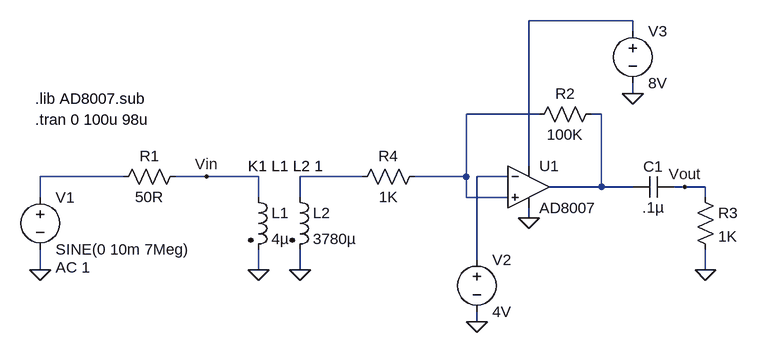
[diagram p0: schematic SMeter Detector - testing.asc]
SMeter Detector - testing.asc, the LTspice schematic file:
Version 4
SHEET 1 1360 680
WIRE 736 -160 576 -160
WIRE 736 -144 736 -160
WIRE 736 -48 736 -64
WIRE 592 -16 480 -16
WIRE 688 -16 672 -16
WIRE 576 64 576 -160
WIRE -48 80 -176 80
WIRE 80 80 32 80
WIRE 160 80 80 80
WIRE 320 80 224 80
WIRE 480 80 480 -16
WIRE 480 80 400 80
WIRE 544 80 496 80
WIRE 688 96 688 -16
WIRE 688 96 608 96
WIRE 736 96 688 96
WIRE 816 96 800 96
WIRE 848 96 816 96
WIRE -176 112 -176 80
WIRE 160 112 160 80
WIRE 224 112 224 80
WIRE 480 112 480 80
WIRE 544 112 480 112
WIRE 848 112 848 96
WIRE 576 144 576 128
WIRE 496 208 496 80
WIRE -176 224 -176 192
WIRE 160 224 160 192
WIRE 224 224 224 192
WIRE 848 224 848 192
WIRE 496 304 496 288
FLAG 160 224 0
FLAG 224 224 0
FLAG -176 224 0
FLAG 80 80 Vin
FLAG 496 304 0
FLAG 848 224 0
FLAG 576 144 0
FLAG 736 -48 0
FLAG 816 96 Vout
SYMBOL ind2 144 96 R0
SYMATTR InstName L1
SYMATTR Value 4µ
SYMATTR Type ind
SYMBOL ind2 208 96 R0
SYMATTR InstName L2
SYMATTR Value 3780µ
SYMATTR Type ind
SYMBOL voltage -176 96 R0
WINDOW 123 24 124 Left 2
WINDOW 39 0 0 Left 2
SYMATTR InstName V1
SYMATTR Value SINE(0 10m 7Meg)
SYMATTR Value2 AC 1
SYMBOL res 48 64 R90
WINDOW 0 0 56 VBottom 2
WINDOW 3 32 56 VTop 2
SYMATTR InstName R1
SYMATTR Value 50R
SYMBOL voltage 496 192 R0
WINDOW 123 0 0 Left 2
WINDOW 39 0 0 Left 2
SYMATTR InstName V2
SYMATTR Value 4V
SYMBOL res 688 -32 R90
WINDOW 0 0 56 VBottom 2
WINDOW 3 32 56 VTop 2
SYMATTR InstName R2
SYMATTR Value 100K
SYMBOL res 832 96 R0
SYMATTR InstName R3
SYMATTR Value 1K
SYMBOL voltage 736 -160 R0
WINDOW 123 0 0 Left 2
WINDOW 39 0 0 Left 2
SYMATTR InstName V3
SYMATTR Value 8V
SYMBOL cap 800 80 R90
WINDOW 0 0 32 VBottom 2
WINDOW 3 32 32 VTop 2
SYMATTR InstName C1
SYMATTR Value .1µ
SYMBOL res 416 64 R90
WINDOW 0 0 56 VBottom 2
WINDOW 3 32 56 VTop 2
SYMATTR InstName R4
SYMATTR Value 1K
SYMBOL Opamps\\opamp2 576 32 R0
SYMATTR InstName U1
SYMATTR Value AD8007
TEXT 144 64 Left 2 !K1 L1 L2 1
TEXT -184 -8 Left 2 !.tran 0 100u 98u
TEXT -184 -40 Left 2 !.lib AD8007.sub

The netlist it stands for:
* SMeter Detector - testing.asc
L1 Vin 0 4µ
L2 N005 0 3780µ
V1 N004 0 SINE(0 10m 7Meg) AC 1
R1 Vin N004 50R
V2 N006 0 4V
R2 N003 N002 100K
R3 Vout 0 1K
V3 N001 0 8V
C1 Vout N003 .1µ
R4 N002 N005 1K
XU1 N002 N006 N001 0 N003 AD8007  ; pins In+ In- V+ V- OUT
K1 L1 L2 1
.tran 0 100u 98u
.lib AD8007.sub
.backanno
.end